# Altium project WINGS.PrjPcb
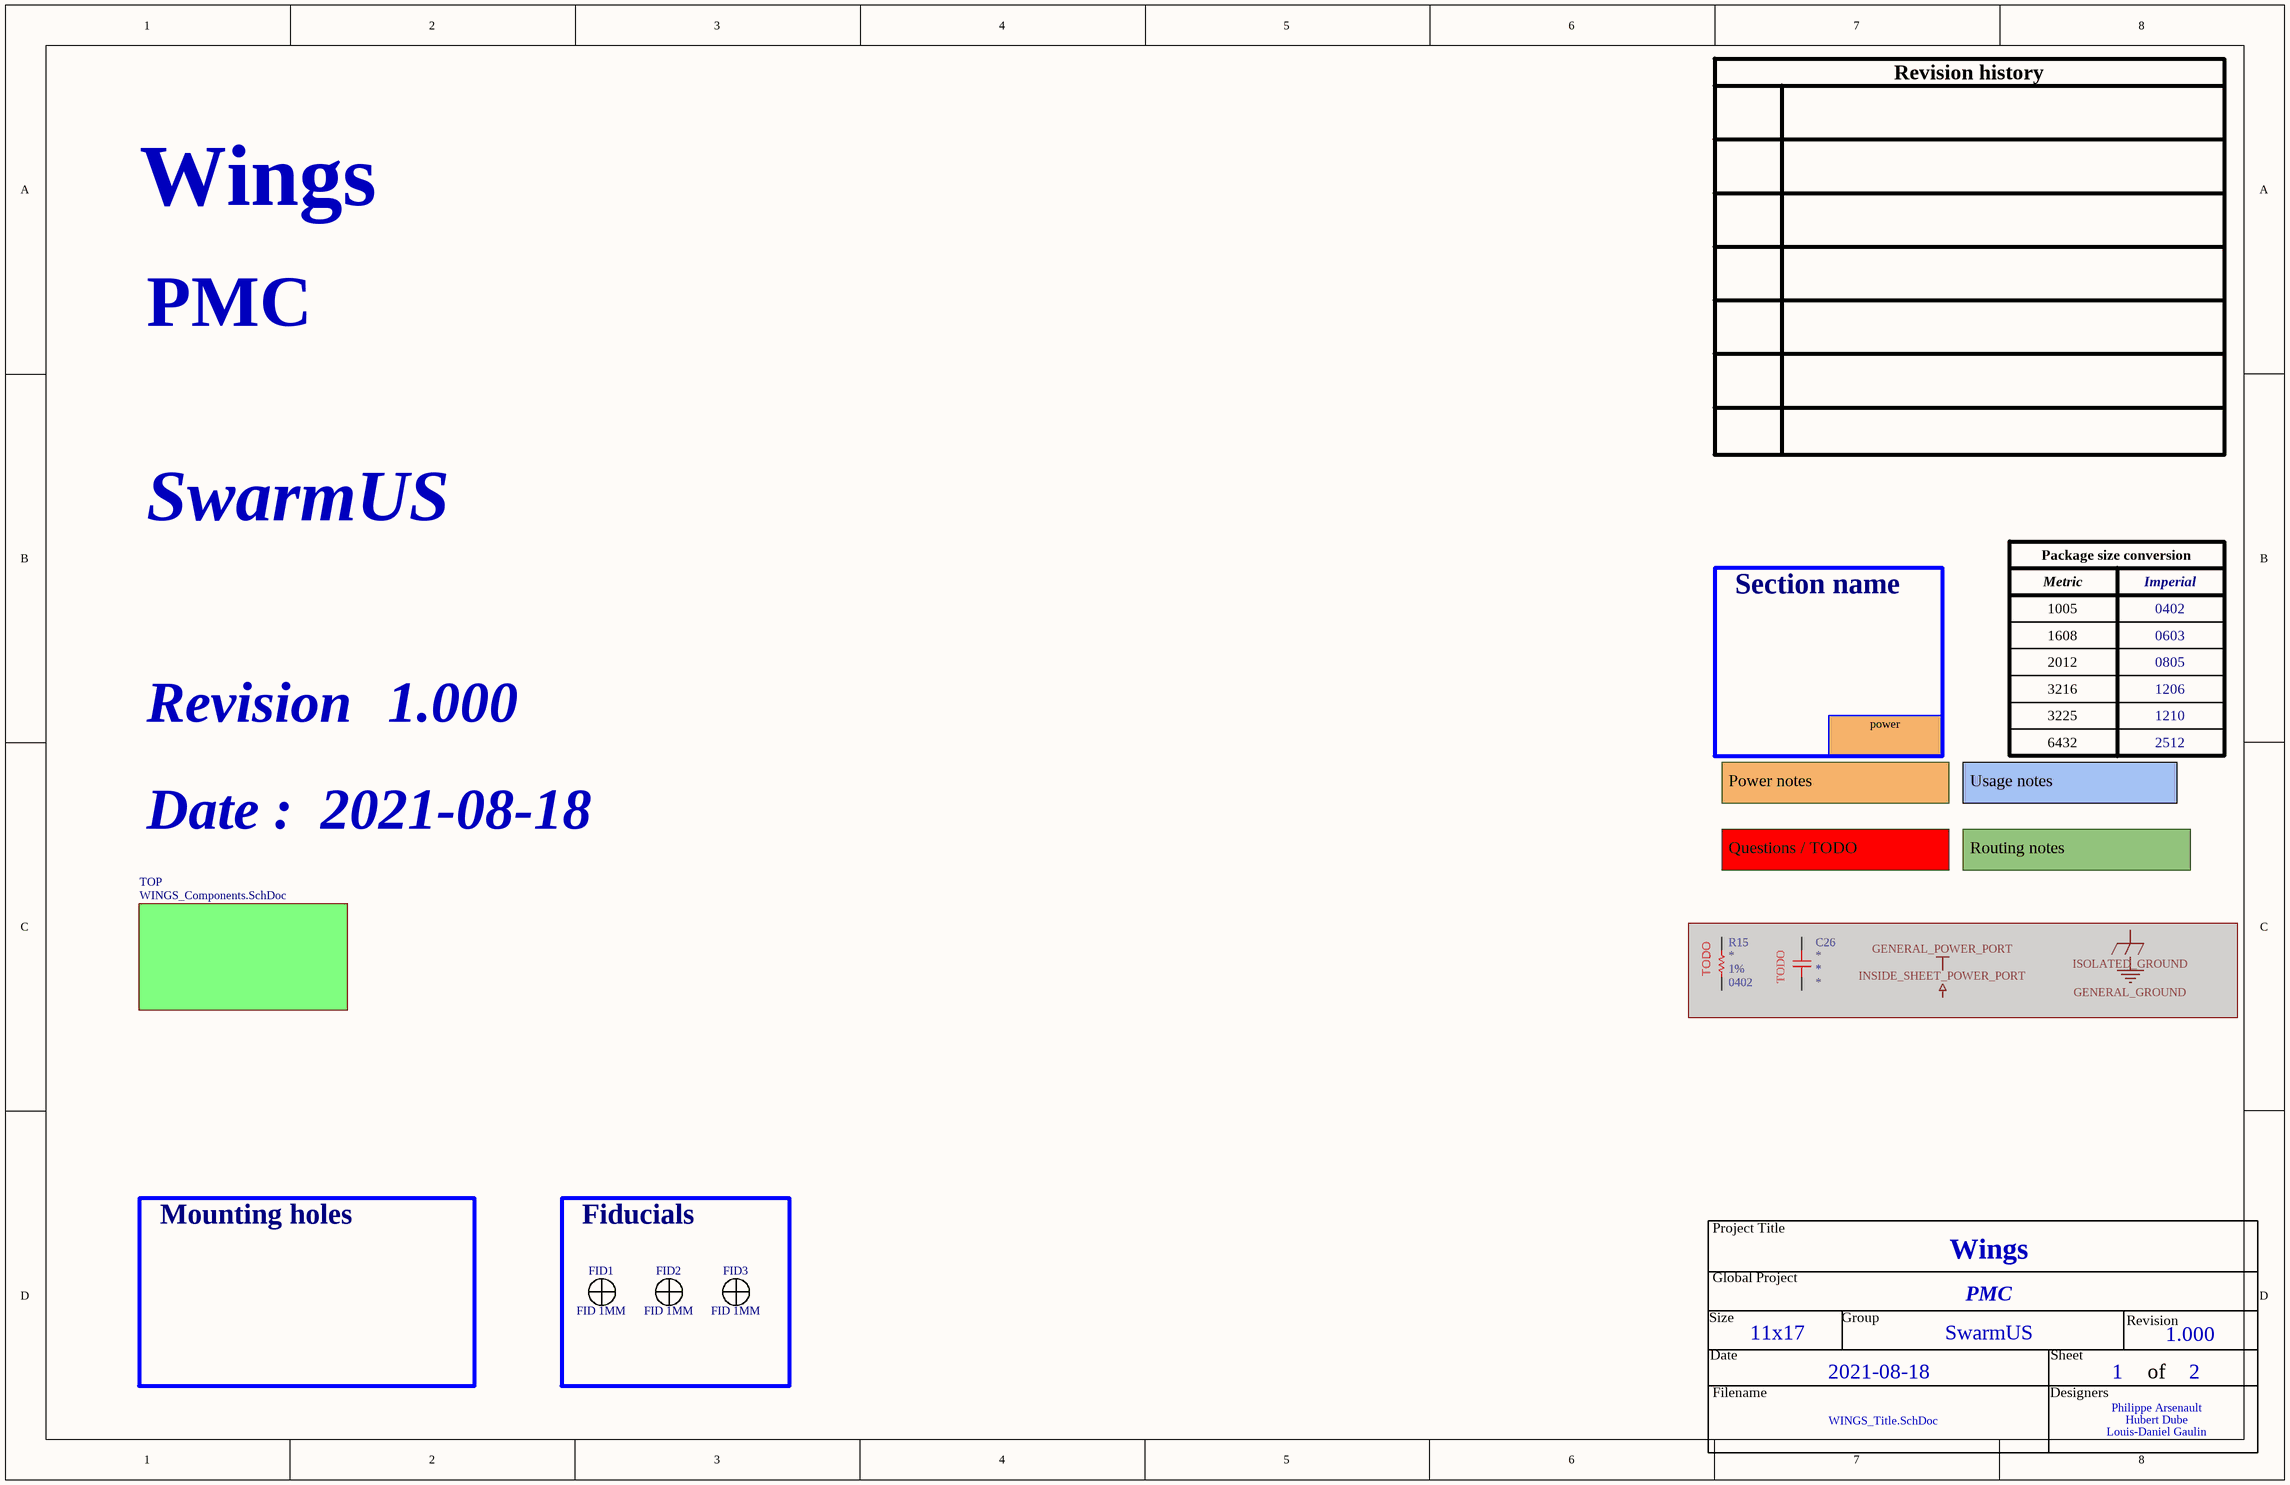
[diagram p0: WINGS_Title.SchDoc]
Project_Date: 2021-08-18; Project_Designer1: Philippe Arsenault; Project_Designer2: Hubert Dube; Project_Designer3: Louis-Daniel Gaulin; Project_Global: PMC; Project_Group: SwarmUS; Project_Name: Wings; Project_Revision: 1.000; Project_Stencil_Bot_Thickness: 0.1 MM; Project_Stencil_Top_Thickness: 0.1 MM
2 sheets, 7 parts. Net scope: hierarchical (ports join the sheet entries above them; power ports are global).
Board file: WINGS.PcbDoc
Sheets:
  WINGS_Title.SchDoc
    TOP = WINGS_Components.SchDoc

## Sheet WINGS_Title.SchDoc
size Tabloid; DocumentNumber: 1; SheetNumber: 1; SheetTotal: 2; Sheet_Name: Title sheet; Size: 11x17

### Parts
C26  PRELIM  [CAP_CER_1812]  (value not drawn)  (masked out: inside a compile mask, not in the netlist)
FID1  FID 1MM  [FID_CIRCLE_1MM]
FID2  FID 1MM  [FID_CIRCLE_1MM]
FID3  FID 1MM  [FID_CIRCLE_1MM]
R15  Tolerance: 1%  Package: 0402  [RES_0402]  (hidden comment: PRELIM)  (masked out: inside a compile mask, not in the netlist)

### Blocks framed on the sheet
Fiducials: FID1-FID3

### Sub-sheets
TOP = WINGS_Components.SchDoc: no entries

### Nets

Not connected (* = marked no-connect by the designer): FID1 1 2; FID2 1 2; FID3 1 2

### Notes on the sheet
- Section name
- power
- Power notes
- Usage notes
- Questions / TODO
- Routing notes
- Mounting holes
- Revision history
- Package size conversion
- Metric
- 1005
- 1608
- Imperial
- 0402
- 0603
- Revision
- 2012
- 3216
- 0805
- 1206
- 3225
- 6432
- 1210
- 2512
- Date :
- Project Title
- Global Project
- Size
- Date
- Group
- Sheet
- of
- Filename
- Designers
- (in symbol CAP_CER_PRELIM) TODO
- (in symbol RES_PRELIM) TODO

### Library data of the parts
C26 = CAP_CER_PRELIM: CAP - CER PRELIM; Manufacturer #1: Würth Elektronik; Part Number #1: 885342211009; Tolerance: 10%; GRAMS Lib Spec: 2.8; Magnetic Material: Unknown; Polarized: No; Current Rating: *; Power Max: *; HelpURL: http://www.vishay.com/docs/45228/hvseries.pdf; CreatedBy/Date: Hubert Dube - 03/02/2021; Temperature: -55°C ~ 125°C; Manufacturer #2: *; Note: *; Assembly Type: SMD; Part Number #2: *; Cryo: UNKNOWN; Supplier 1: Digi-Key; Supplier Part Number 1: 732-12109-1-ND; Package: *; Voltage Rating: *; Value: *
FID1-FID3 = FID_CIRCLE_1MM: FID - FIDUCIAL 1MM CIRCLE DOUBLE-SIDED - 1MM; GRAMS Lib Spec: 2.8; Magnetic Material: NO; Cryo: UNKNOWN; Value: *; Tolerance: *; Voltage Rating: *; Current Rating: *; Power Max: *; HelpURL: https://www.pcb-3d.com/wordpress/wp-content/uploads/ipc-sm-782a_amendment_1_and_2.pdf; CreatedBy/Date: Jonathan Bouchard 2018-07-23; VerifiedBy: Caroline Paulin - 25 juillet 2018; Temperature: *; Package: 1MM CIRCLE; Manufacturer #1: *; Manufacturer #2: *; Note: *; Assembly Type: NONE; Part Number #2: *; Part Number #1: *; Polarized: *; Supplier 1: *; Supplier Part Number 1: *; Solder Paste Type: UNKNOWN; Stencil Thickness (Recommended): UNKNOWN
R15 = RES_PRELIM: RES -PRELIM; Manufacturer #1: Yageo; Part Number #1: RC0402FR-0775RL; GRAMS Lib Spec: 2.8c; Power Max: 1/16W; Magnetic Material: Unknown; Polarized: No; Voltage Rating: 50V; Assembly Type: SMD; CreatedBy/Date: Hubert Dubé - 3/02/2020; Current Rating: *; HelpURL: https://www.yageo.com/upload/media/product/productsearch/datasheet/rchip/PYu-RC_Group_51_RoHS_L_11.pdf; Manufacturer #2: *; Note: *; Part Number #2: *; Temperature: -55°C ~ 155°C; Value: *

## Sheet WINGS_Components.SchDoc
size Tabloid; Revision: 1.000; SheetNumber: 2; SheetTotal: 2; Sheet_Name: Wings Components; Size: 11x17
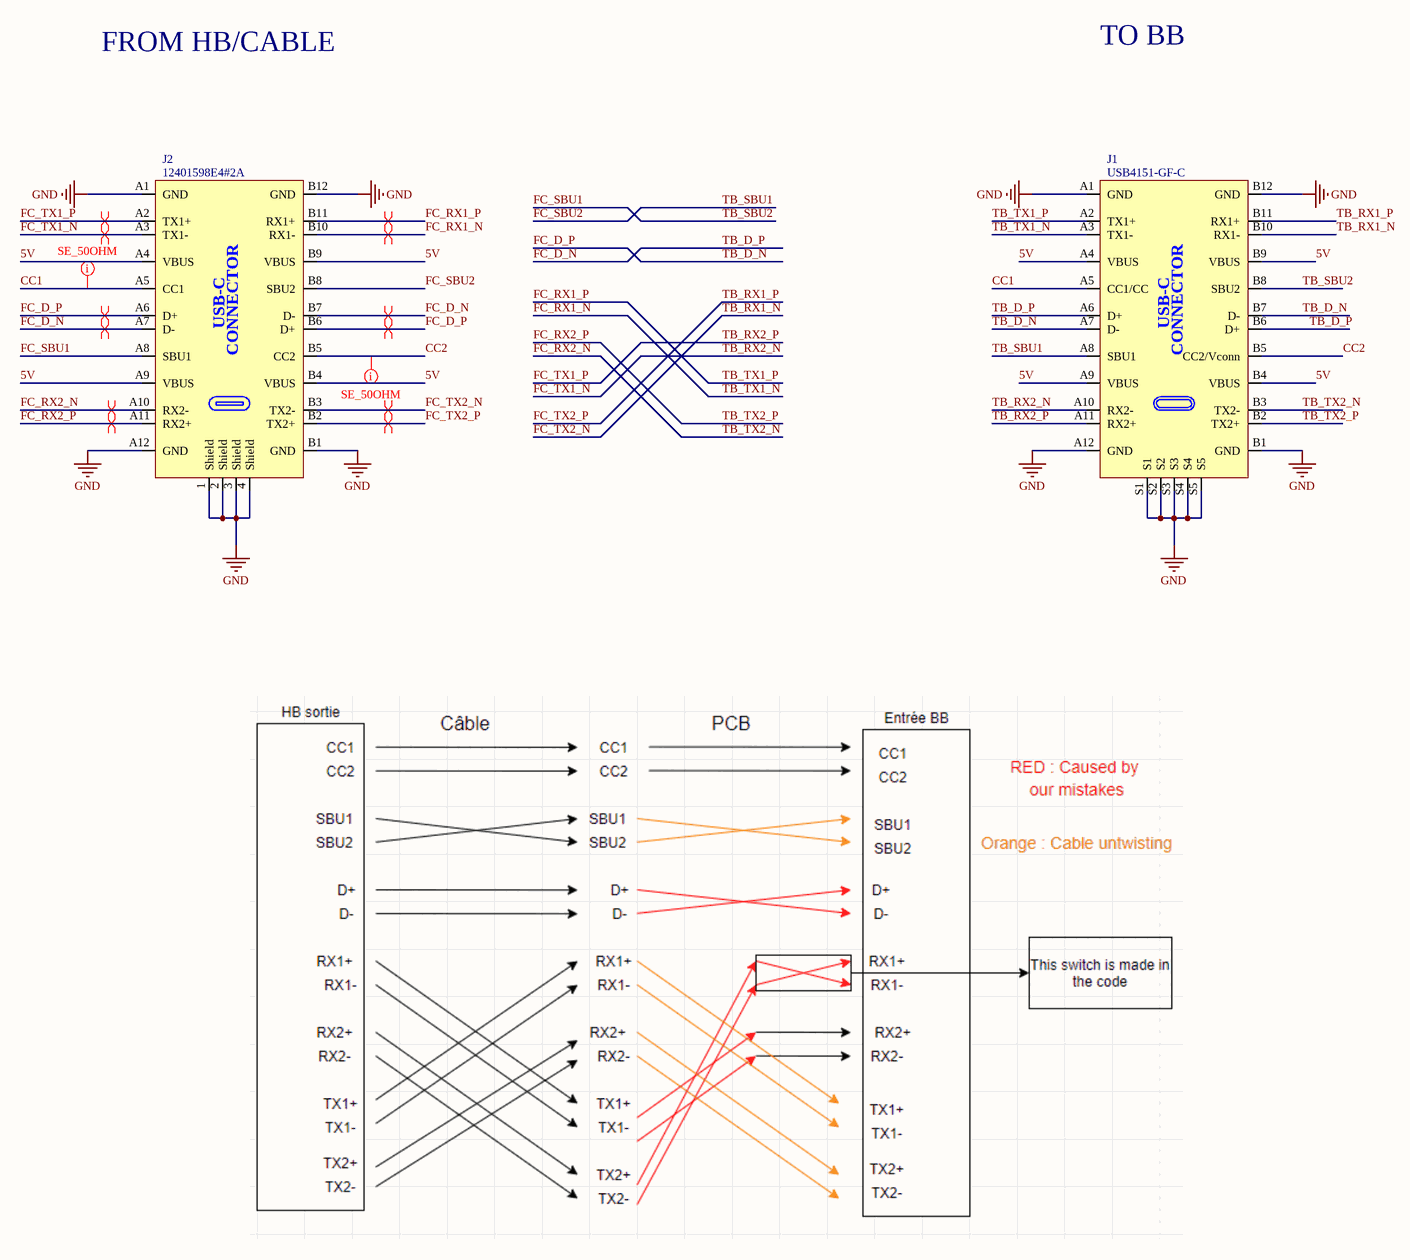
[diagram p1: WINGS_Components.SchDoc]

### Parts
J1  USB4151-GF-C  [CON_USB-C_USB4151-GF-C]
J2  12401598E4#2A  [CON_USB_3.2_TypeC_12401598E4#2A]

### Nets
GND: J1.A1(GND) J1.A12(GND) J1.B1(GND) J1.B12(GND) J1.S1 J1.S2 J1.S3 J1.S4 J1.S5 J2.1(Shield) J2.2(Shield) J2.3(Shield) J2.4(Shield) J2.A1(GND) J2.A12(GND) J2.B1(GND) J2.B12(GND)
5V: J1.A4(VBUS) J1.A9(VBUS) J1.B4(VBUS) J1.B9(VBUS) J2.A4(VBUS) J2.A9(VBUS) J2.B4(VBUS) J2.B9(VBUS)
CC1: J1.A5(CC1/CC) J2.A5(CC1)
CC2: J1.B5(CC2/Vconn) J2.B5(CC2)
FC_D_N: J1.A6(D+) J1.B6(D+) J2.A7(D-) J2.B7(D-)  [also labelled TB_D_P]
FC_D_P: J1.A7(D-) J1.B7(D-) J2.A6(D+) J2.B6(D+)  [also labelled TB_D_N]
FC_RX1_N: J1.A3(TX1-) J2.B10(RX1-)  [also labelled TB_TX1_N]
FC_RX1_P: J1.A2(TX1+) J2.B11(RX1+)  [also labelled TB_TX1_P]
FC_RX2_N: J1.B3(TX2-) J2.A10(RX2-)  [also labelled TB_TX2_N]
FC_RX2_P: J1.B2(TX2+) J2.A11(RX2+)  [also labelled TB_TX2_P]
FC_SBU1: J1.B8(SBU2) J2.A8(SBU1)  [also labelled TB_SBU2]
FC_SBU2: J1.A8(SBU1) J2.B8(SBU2)  [also labelled TB_SBU1]
FC_TX1_N: J1.A10(RX2-) J2.A3(TX1-)  [also labelled TB_RX2_N]
FC_TX1_P: J1.A11(RX2+) J2.A2(TX1+)  [also labelled TB_RX2_P]
FC_TX2_N: J1.B10(RX1-) J2.B3(TX2-)  [also labelled TB_RX1_N]
FC_TX2_P: J1.B11(RX1+) J2.B2(TX2+)  [also labelled TB_RX1_P]

### Layout directives
mark named SE_50OHM: CC1, CC2
differential pair; differential pair class DIFF_90: FC_D_N, FC_D_P, FC_TX1_N, FC_TX1_P, FC_TX2_N, FC_TX2_P
differential pair; differential pair class DIFF_90; net class TX: FC_RX1_N, FC_RX1_P, FC_RX2_N, FC_RX2_P

### Notes on the sheet
- FROM HB/CABLE
- TO BB
- Sheet Name
- Project Title
- Global Project
- Size
- Date
- Group
- Sheet
- Revision
- of
- PCB
- .
- SCH
- Filename
- Designers
- (in symbol CON_USB_3.2_TypeC_12401598E4#2A) USB-C; CONNECTOR
- (in symbol CON_USB_3.2_TypeC_USB4151-GF-C) USB-C; CONNECTOR

### Library data of the parts
J1 = CON_USB_3.2_TypeC_USB4151-GF-C: CON - USB-C (USB TYPE-C) USB 3.2 Gen 1 (USB 3.1 Gen 1, Superspeed (USB 3.0)) Plug Connector 24 Position Surface Mount, Through Hole; Manufacturer #1: GCT; Value: USB 3.2 Type C; Voltage Rating: 20VDC; Current Rating: 5A total; GRAMS Lib Spec: 2.8; Note: Vertical; Magnetic Material: Unknown; Polarized: Yes; Power Max: -; HelpURL: https://gct.co/connector/usb4151; CreatedBy/Date: Philippe Arsenault/2021-08-17; VerifiedBy: Hubert Dube/2021-09-02; Temperature: -40°C ~ 85°C; Package: SMD/TH; Assembly Type: SMD/TH; Part Number #1: USB4151-GF-C; Supplier 1: Digi-Key; Supplier Part Number 1: 2073-USB4151-GF-CCT-ND
J2 = CON_USB_3.2_TypeC_12401598E4#2A: CON_USB - USB 3.2 Gen 2 (USB 3.1 Gen 2, Superspeed + (USB 3.1)) 24 pos Receptacle - R/A; Manufacturer #1: Amphenol ICC (Commercial Products); Value: USB 3.2 Type C; Current Rating: 5A total; GRAMS Lib Spec: 2.8; Magnetic Material: Unknown; Polarized: Yes; Voltage Rating: -; Power Max: -; HelpURL: https://www.amphenol-icc.com/media/wysiwyg/files/drawing/12401598xxx2a.pdf; CreatedBy/Date: Louis-Daniel Gaulin / 07-04-2021; VerifiedBy: Philippe Arsenault/2021-04-08; Temperature: max 105°C; Package: SMD + TH R/A; Assembly Type: SMD + TH; Part Number #1: 12401598E4#2A; Supplier 1: Digi-Key; Supplier Part Number 1: 12401598E4#2ACT-ND